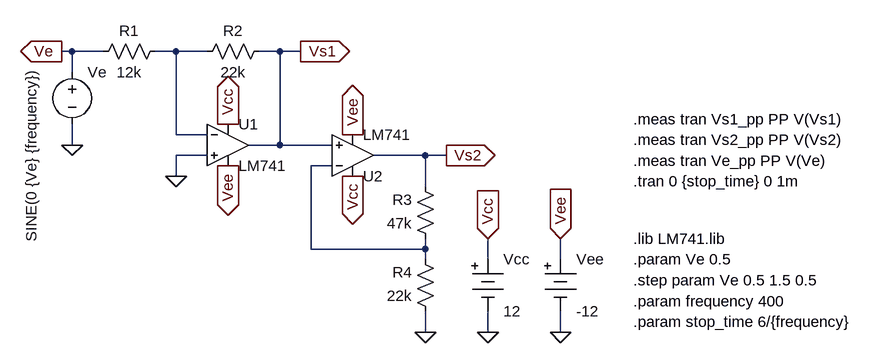
[diagram p0: schematic Exp4.asc]
Exp4.asc, the LTspice schematic file:
Version 4.1
SHEET 1 2388 680
WIRE -496 0 -512 0
WIRE -448 0 -496 0
WIRE -336 0 -368 0
WIRE -288 0 -336 0
WIRE -176 0 -208 0
WIRE -144 0 -176 0
WIRE -496 32 -496 0
WIRE -336 128 -336 0
WIRE -288 128 -336 128
WIRE -496 144 -496 112
WIRE -176 144 -176 0
WIRE -176 144 -224 144
WIRE -96 144 -176 144
WIRE -288 160 -336 160
WIRE 48 160 -32 160
WIRE 80 160 48 160
WIRE -96 176 -128 176
WIRE -336 192 -336 160
WIRE 48 208 48 160
WIRE -128 304 -128 176
WIRE 48 304 48 288
WIRE 48 304 -128 304
WIRE 48 320 48 304
WIRE 144 320 144 288
WIRE 256 320 256 288
WIRE 48 432 48 400
WIRE 144 432 144 400
WIRE 256 432 256 400
FLAG 256 288 Vee
IOPIN 256 288 In
FLAG 144 288 Vcc
IOPIN 144 288 In
FLAG -256 112 Vcc
IOPIN -256 112 Out
FLAG -256 176 Vee
IOPIN -256 176 Out
FLAG -496 144 0
FLAG 144 432 0
FLAG 256 432 0
FLAG 80 160 Vs2
IOPIN 80 160 Out
FLAG -512 0 Ve
IOPIN -512 0 Out
FLAG -336 192 0
FLAG -64 192 Vcc
IOPIN -64 192 Out
FLAG -64 128 Vee
IOPIN -64 128 Out
FLAG 48 432 0
FLAG -144 0 Vs1
IOPIN -144 0 Out
SYMBOL OpAmps\\LM741 -256 80 R0
SYMATTR InstName U1
SYMBOL voltage -496 16 R0
WINDOW 123 0 0 Left 0
WINDOW 39 0 0 Left 0
WINDOW 3 -63 9 VRight 2
SYMATTR Value SINE(0 {Ve} {frequency})
SYMATTR InstName Ve
SYMBOL Misc\\battery 144 304 R0
SYMATTR InstName Vcc
SYMATTR Value 12
SYMBOL Misc\\battery 256 304 R0
SYMATTR InstName Vee
SYMATTR Value -12
SYMBOL res -352 -16 R90
WINDOW 0 0 56 VBottom 2
WINDOW 3 32 56 VTop 2
SYMATTR InstName R1
SYMATTR Value 12k
SYMBOL res -192 -16 R90
WINDOW 0 0 56 VBottom 2
WINDOW 3 32 56 VTop 2
SYMATTR InstName R2
SYMATTR Value 22k
SYMBOL OpAmps\\LM741 -64 224 M180
SYMATTR InstName U2
SYMBOL res 64 304 R180
WINDOW 0 36 76 Left 2
WINDOW 3 36 40 Left 2
SYMATTR InstName R3
SYMATTR Value 47k
SYMBOL res 64 416 R180
WINDOW 0 36 76 Left 2
WINDOW 3 36 40 Left 2
SYMATTR InstName R4
SYMATTR Value 22k
TEXT 368 320 Left 2 !.param Ve 0.5
TEXT 368 352 Left 2 !.step param Ve 0.5 1.5 0.5
TEXT 368 384 Left 2 !.param frequency 400
TEXT 368 200 Left 2 !.tran 0 {stop_time} 0 1m
TEXT 368 416 Left 2 !.param stop_time 6/{frequency}
TEXT 368 168 Left 2 !.meas tran Ve_pp PP V(Ve)
TEXT 368 288 Left 2 !.lib LM741.lib
TEXT 368 104 Left 2 !.meas tran Vs1_pp PP V(Vs1)
TEXT 368 136 Left 2 !.meas tran Vs2_pp PP V(Vs2)

The netlist it stands for:
* Exp4.asc
X§U1 0 N001 Vcc Vee Vs1 LM741  ; pins In+ In- V+ V- OUT
Ve Ve 0 SINE(0 {Ve} {frequency})
Vcc Vcc 0 12
Vee Vee 0 -12
R1 N001 Ve 12k
R2 Vs1 N001 22k
X§U2 Vs1 N002 Vcc Vee Vs2 LM741  ; pins In+ In- V+ V- OUT
R3 N002 Vs2 47k
R4 0 N002 22k
.param Ve 0.5
.step param Ve 0.5 1.5 0.5
.param frequency 400
.tran 0 {stop_time} 0 1m
.param stop_time 6/{frequency}
.meas tran Ve_pp PP V(Ve)
.lib LM741.lib
.meas tran Vs1_pp PP V(Vs1)
.meas tran Vs2_pp PP V(Vs2)
.lib LM741.lib
.backanno
.end